# EAGLE design LedEsp32 (EAGLE 9.6.2)
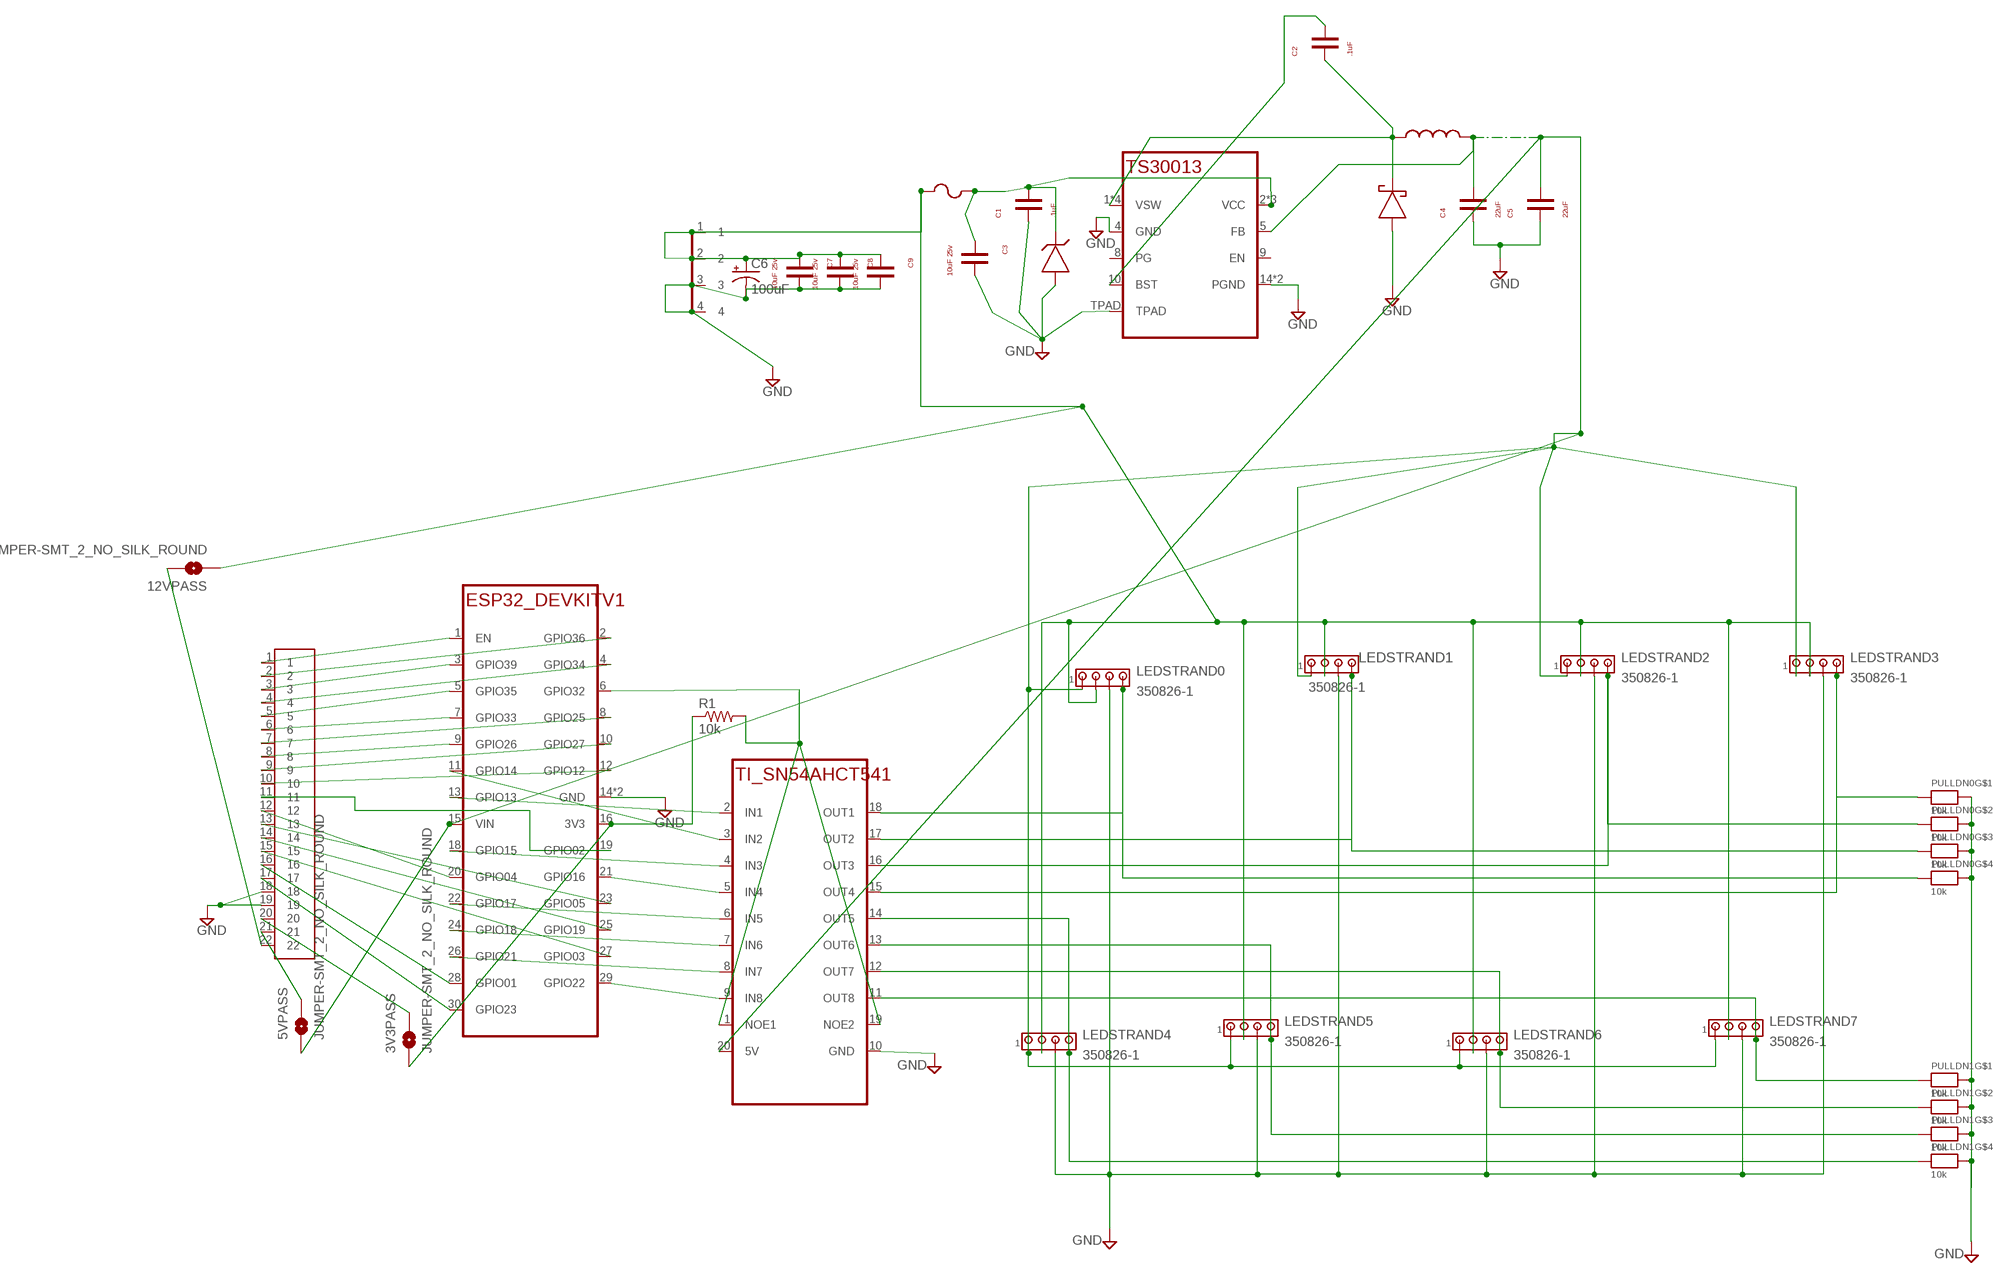
[diagram p0: schematic, sheet 1]

## Parts
3V3PASS  JUMPER-SMT_2_NO_SILK_ROUND  [SMT-JUMPER_2_NO_SILK_ROUND]
5VPASS  JUMPER-SMT_2_NO_SILK_ROUND  [SMT-JUMPER_2_NO_SILK_ROUND]
12VPASS  JUMPER-SMT_2_NO_SILK_ROUND  [SMT-JUMPER_2_NO_SILK_ROUND]
C1  .1uF  CAPACITOR_NONPOLARC0603  [C0603]
C2  .1uF  CAPACITOR_NONPOLARC0603  [C0603]
C3  10uF 25v  CL31A106MAHNNNEC1206  [C1206]
C4  22uF  GRM188R61A226ME15DC0603  [C0603]
C5  22uF  GRM188R61A226ME15DC0603  [C0603]
C6  100uF  CPOL-USE2.5-6  [E2,5-6]
C7  10uF 25v  CL31A106MAHNNNEC1206  [C1206]
C8  10uF 25v  CL31A106MAHNNNEC1206  [C1206]
C9  10uF 25v  CL31A106MAHNNNEC1206  [C1206]
D2  LS54LS54  [LS54]
F1  3A  FUSER0603  [R0603]
IC1  TS30013QFN16  [QFN16]
L1  SRN5040TA-4R7MSRN5040TA  [SRN5040TA]
LEDSTRAND0  350826-1  [350826-1]
LEDSTRAND1  350826-1  [350826-1]
LEDSTRAND2  350826-1  [350826-1]
LEDSTRAND3  350826-1  [350826-1]
LEDSTRAND4  350826-1  [350826-1]
LEDSTRAND5  350826-1  [350826-1]
LEDSTRAND6  350826-1  [350826-1]
LEDSTRAND7  350826-1  [350826-1]
PULLDN0  10k  RESISTOR_4PACK  [RESPACK_4X0603]
PULLDN1  10k  RESISTOR_4PACK  [RESPACK_4X0603]
R1  10k  R-US_R0603  [R0603]
U$1  ESP32_DEVKITV1ESP32_DEVKITV1DEVINST  [ESP32_DEVKITV1]
U$2  TI_SN54AHCT541SO20WDEVINST  [SO20W]
U$3  1X22THM  [1X22]
U$4  TE-1969806-1TE-1969806-1DEVINST  [TE-1969806-1]
Z1  CZRB5353B-HF DO-214AADEVINST  CZRB5353B-HF‎DO-214AADEVINST  [DO-214AA]

## Nets
3V3: 3V3PASS.1 R1.1 U$1.16(3V3)
3V3PASS [general_data]: 3V3PASS.2 U$3.20
GND: C1.1 C3.2 C4.1 C5.1 C6.- C7.2 C8.2 C9.2 D2.1 IC1.4(GND) IC1.14(PGND) IC1.15(PGND) IC1.TPAD LEDSTRAND0.3 LEDSTRAND1.3 LEDSTRAND2.3 LEDSTRAND3.3 LEDSTRAND4.3 LEDSTRAND5.3 LEDSTRAND6.3 LEDSTRAND7.3 PULLDN0.5 PULLDN0.6 PULLDN0.7 PULLDN0.8 PULLDN1.5 PULLDN1.6 PULLDN1.7 PULLDN1.8 U$1.14(GND) U$1.17(GND) U$2.10(GND) U$3.18 U$3.19 U$4.3 U$4.4 Z1.1
LEDEN [general_data]: R1.2 U$1.6(GPIO32) U$2.1(NOE1) U$2.19(NOE2)
N$1 [general_data]: LEDSTRAND0.4 PULLDN0.4 U$2.18(OUT1)
N$2 [general_data]: U$1.19(GPIO02) U$3.11
N$3 [general_data]: C2.1 D2.2 IC1.1(VSW) IC1.12(VSW) IC1.13(VSW) IC1.16(VSW) L1.1
N$5 [general_data]: C2.2 IC1.10(BST)
N$6 [general_data]: LEDSTRAND1.4 PULLDN0.3 U$2.17(OUT2)
N$7 [general_data]: LEDSTRAND2.4 PULLDN0.2 U$2.16(OUT3)
N$8 [general_data]: LEDSTRAND3.4 PULLDN0.1 U$2.15(OUT4)
N$9 [general_data]: LEDSTRAND4.4 PULLDN1.4 U$2.14(OUT5)
N$10 [general_data]: LEDSTRAND5.4 PULLDN1.3 U$2.13(OUT6)
N$11 [general_data]: LEDSTRAND6.4 PULLDN1.2 U$2.12(OUT7)
N$12 [general_data]: LEDSTRAND7.4 PULLDN1.1 U$2.11(OUT8)
N$13 [general_data]: U$1.11(GPIO14) U$2.3(IN2)
N$14 [general_data]: U$1.13(GPIO13) U$2.2(IN1)
N$15 [general_data]: U$1.18(GPIO15) U$2.4(IN3)
N$16 [general_data]: U$1.21(GPIO16) U$2.5(IN4)
N$17 [general_data]: U$1.22(GPIO17) U$2.6(IN5)
N$18 [general_data]: U$1.24(GPIO18) U$2.7(IN6)
N$19 [general_data]: U$1.26(GPIO21) U$2.8(IN7)
N$20 [general_data]: U$1.29(GPIO22) U$2.9(IN8)
N$23 [general_data]: U$1.1(EN) U$3.1
N$24 [general_data]: U$1.2(GPIO36) U$3.2
N$25 [general_data]: U$1.3(GPIO39) U$3.3
N$26 [general_data]: U$1.4(GPIO34) U$3.4
N$27 [general_data]: U$1.5(GPIO35) U$3.5
N$28 [general_data]: U$1.7(GPIO33) U$3.6
N$29 [general_data]: U$1.8(GPIO25) U$3.7
N$30 [general_data]: U$1.9(GPIO26) U$3.8
N$31 [general_data]: U$1.10(GPIO27) U$3.9
N$32 [general_data]: U$1.12(GPIO12) U$3.10
N$34 [general_data]: U$1.20(GPIO04) U$3.12
N$35 [general_data]: U$1.23(GPIO05) U$3.13
N$36 [general_data]: U$1.25(GPIO19) U$3.14
N$37 [general_data]: U$1.27(GPIO03) U$3.15
N$38 [general_data]: U$1.28(GPIO01) U$3.16
N$39 [general_data]: U$1.30(GPIO23) U$3.17
N$40 [general_data]: 5VPASS.2 U$3.21
N$41 [general_data]: 12VPASS.2 U$3.22
V5: 5VPASS.1 C4.2 C5.2 IC1.5(FB) L1.2 LEDSTRAND0.1 LEDSTRAND1.1 LEDSTRAND2.1 LEDSTRAND3.1 LEDSTRAND4.1 LEDSTRAND5.1 LEDSTRAND6.1 LEDSTRAND7.1 U$1.15(VIN) U$2.20(5V)
V12_FUSED: C1.2 C3.1 F1.2 IC1.2(VCC) IC1.3(VCC) IC1.11(VCC) Z1.2
VCC: 12VPASS.1 C6.+ C7.1 C8.1 C9.1 F1.1 LEDSTRAND0.2 LEDSTRAND1.2 LEDSTRAND2.2 LEDSTRAND3.2 LEDSTRAND4.2 LEDSTRAND5.2 LEDSTRAND6.2 LEDSTRAND7.2 U$4.1 U$4.2
Unconnected: IC1.8(PG) IC1.9(EN)

## Library data of the parts
3V3PASS 5VPASS 12VPASS = SparkFun-Jumpers:JUMPER-SMT_2_NO: Normally open jumper This jumper has two pads in close proximity to each other. Apply solder to close the connection. Round pads are easier to solder for beginners, but are a lot larger. SparkFun Product that uses the round pads: SparkFun EL Sequencer <https://www.sparkfun.com/products/12781>
C1 C2 = ledinlinesupply:CAPACITOR_NONPOLAR
C3 C7-C9 = ledinlinesupply:CL31A106MAHNNNE
C4 C5 = ledinlinesupply:GRM188R61A226ME15D
C6 = rcl:CPOL-US: POLARIZED CAPACITOR, American symbol; SPICEPREFIX: C
D2 = ledinlinesupply:LS54
F1 = ledinlinesupply:FUSE
IC1 = ledinlinesupply:TS30013
L1 = ledinlinesupply:SRN5040TA-4R7M
LEDSTRAND0 LEDSTRAND1-LEDSTRAND7 = con-amp:350826-1: Universal MATE-N-LOK .250" Centerline, 600 V, 19 - 36 A max Source: http://catalog.tycoelectronics.com/ .. ENG_CD_350826_P.pdf
PULLDN0 PULLDN1 = microbuilder:RESISTOR_4PACK: Resistor Packs (4 resistors) 4 x 0603 10K 1/16W - Digikey: YC164J-10KCT-ND
R1 = adafruit:R-US_: RESISTOR, American symbol
U$1 = esp32:ESP32_DEVKITV1
U$2 = esp32:TI_SN54AHCT541
U$3 = adafruit:1X22
U$4 = ledinlinesupply:TE-1969806-1
Z1 = ledinlinesupply:CZRB5353B-HF‎

## Net classes
1 general_data: width 0.305 mm
3 CHIPCOM: width 0.203 mm, clearance 0.152 mm

## Board
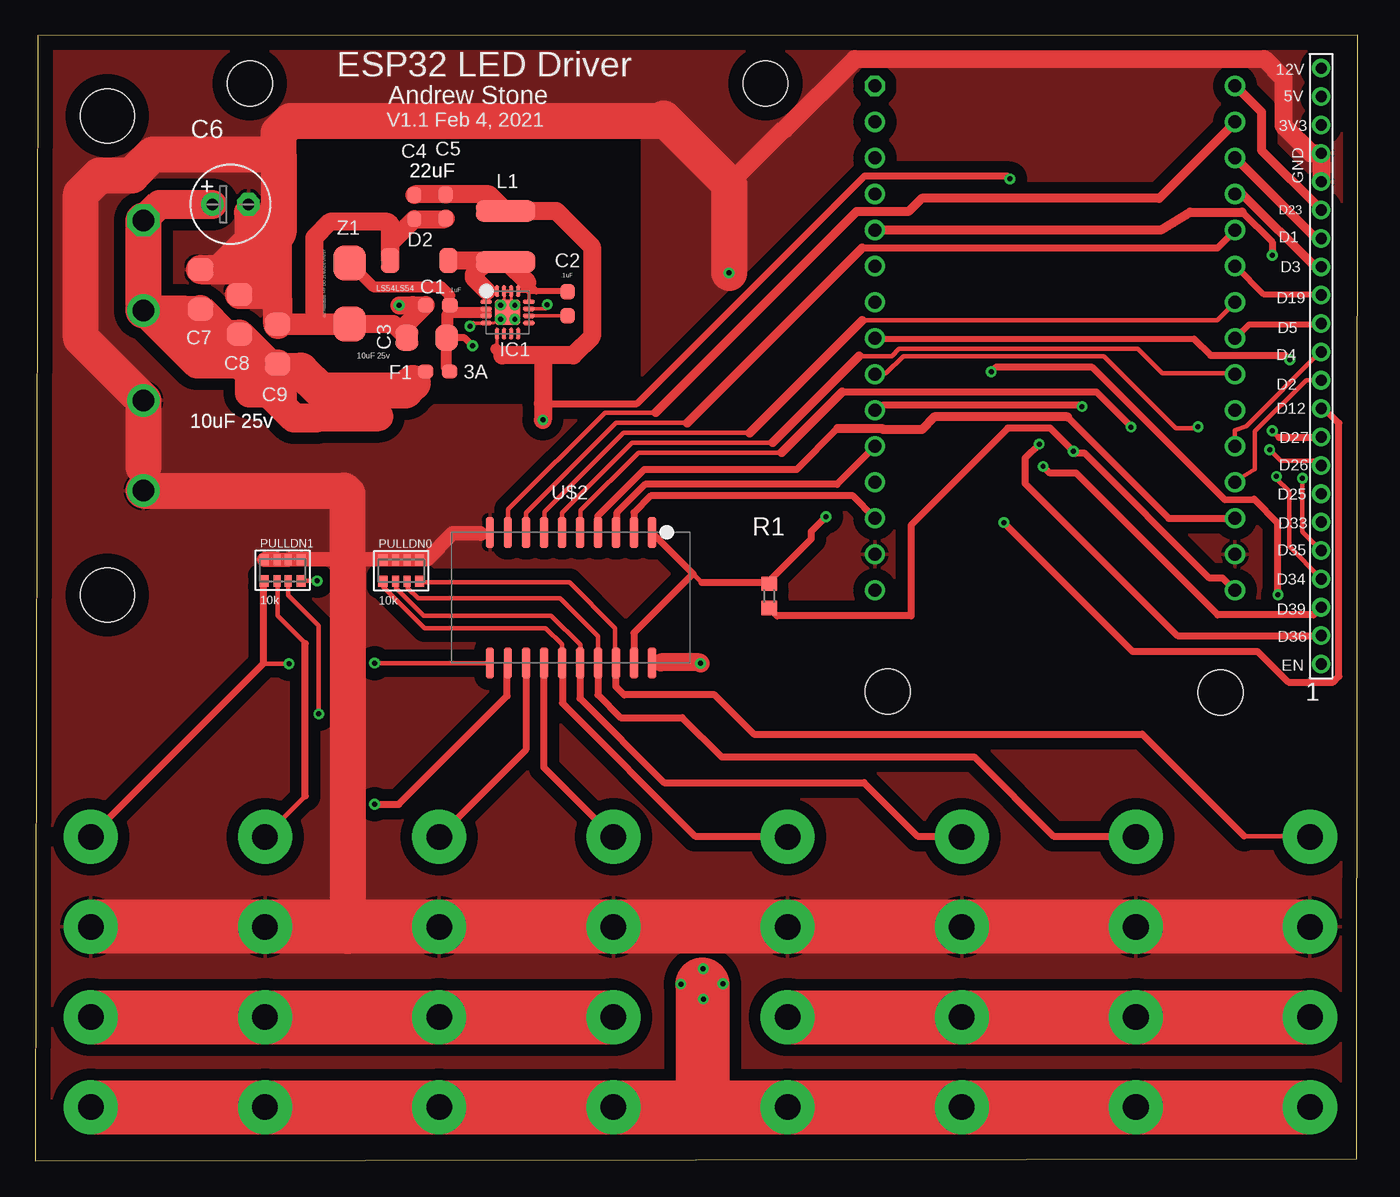
[diagram p1: board, top side]
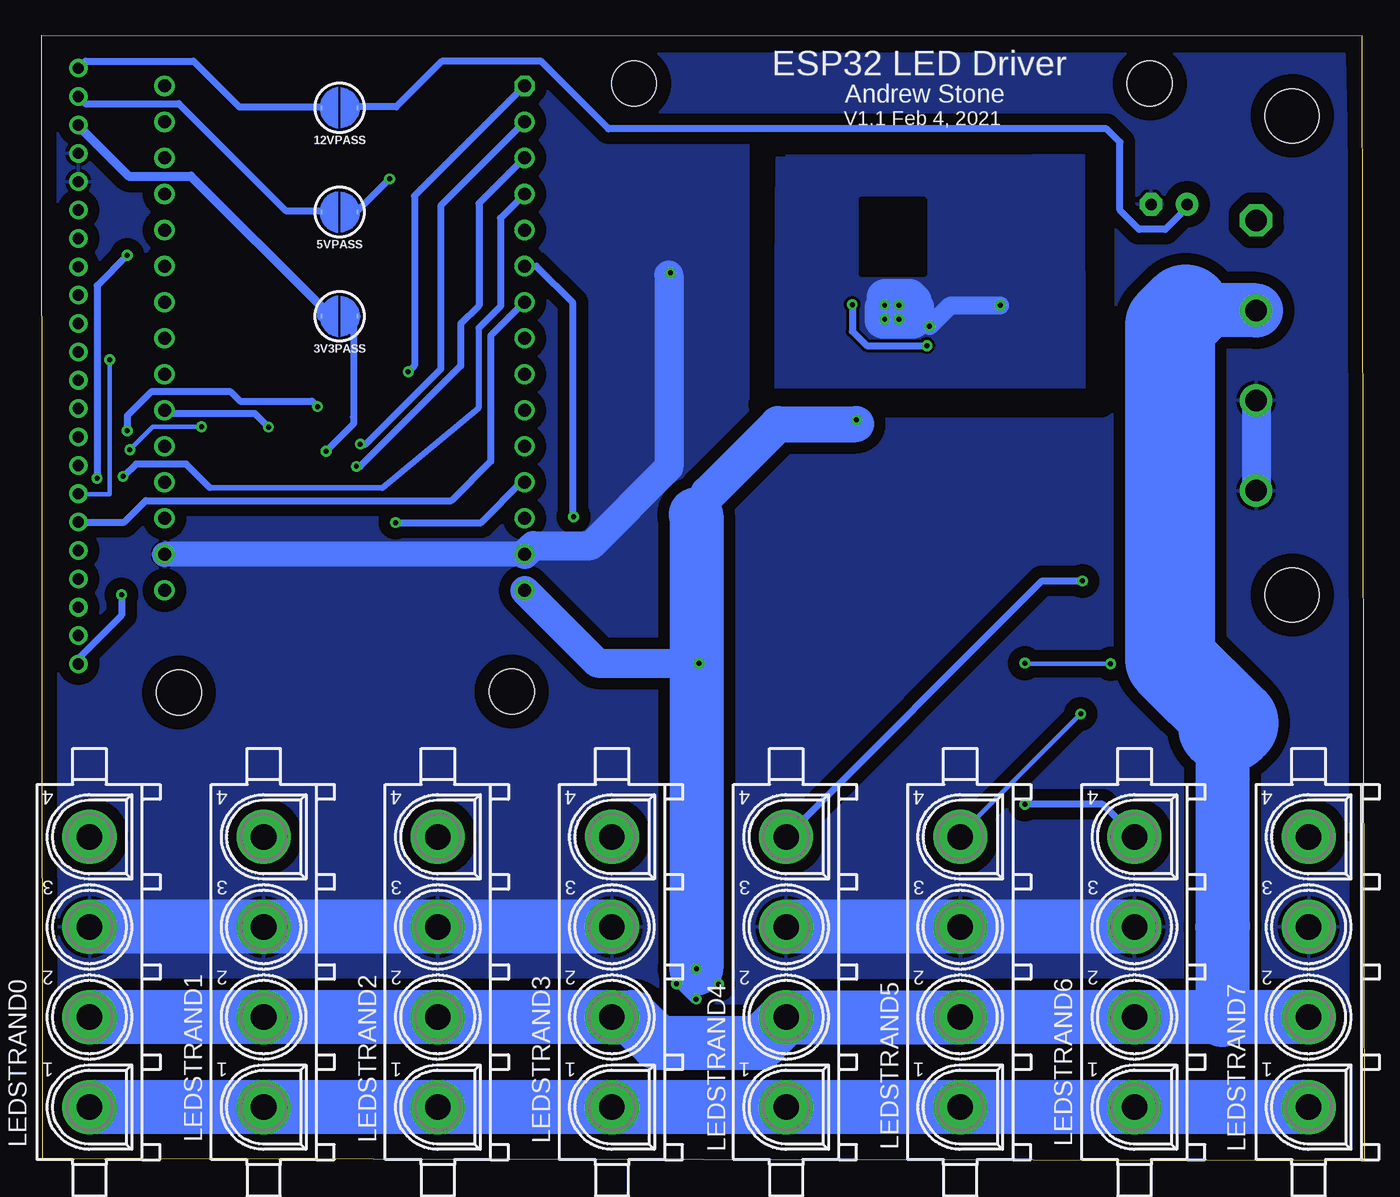
[diagram p2: board, bottom side, seen from below]

Size 93.25 x 79.33 mm. Coordinates in mm from the lower left corner, seen from the top.
Outline: 0,0 93.18,0.13 93.25,79.33 0.18,79.3 0,0
Copper layers (1*16): Top 0.035mm / dielectric 1.5mm / Bottom 0.035mm
Design rules "default *": minimum track width 8mil, minimum drill 0.35mm, track to track 8mil, track to pad 8mil, pad to pad 8mil, via to via 8mil, smd to smd 8mil, copper to edge 40mil, drill to drill 6mil, minimum pad ring 10mil, minimum via ring 8mil, stop-mask expansion 4mil, vias tented up to drill 0mil, thermal gap 10mil
Holes 3.17 mm at 15.11,75.95 51.48,75.95 60.11,33.08 83.58,33.01
tKeepout: area 30.9,62.4 to 35.5,67.9
tRestrict: area 30.9,62.5 to 35.5,67.9; area 18.6,53.6 to 41.8,71.9; area 18.5,53.5 to 19.6,71.9
bRestrict: area 30.9,62.4 to 35.5,67.8; area 18.5,53.3 to 42.5,72; area 18.5,53.3 to 19.6,71.9

### Footprints (pad centres in the part's own frame; a part is rotated, then mirrored left to right if it is on the bottom)
SMT-JUMPER_2_NO_SILK_ROUND = smd 0.152 x 0.305: 1 -1.27,0; 2 1.27,0
C0603 = smd 1.1 x 1: 1 -0.85,0; 2 0.85,0
C1206 = smd 1.6 x 1.8: 1 -1.4,0; 2 1.4,0
E2,5-6 = drill 0.813 pad 1.6: + -1.27,0 | drill 0.813 pad 1.6 octagon: - 1.27,0
LS54 = smd 1.3 x 1.75: 1 -2.05,0; 2 2.05,0
R0603 = smd 1.1 x 1: 1 -0.85,0; 2 0.85,0
QFN16 = smd 0.8 x 0.3: 1 -1.5,0.75; 2 -1.5,0.25; 3 -1.5,-0.25; 4 -1.5,-0.75; 9 1.5,-0.75; 10 1.5,-0.25; 11 1.5,0.25; 12 1.5,0.75 | smd 0.3 x 0.8: 5 -0.75,-1.5; 6 -0.25,-1.5; 7 0.25,-1.5; 8 0.75,-1.5; 13 0.75,1.5; 14 0.25,1.5; 15 -0.25,1.5; 16 -0.75,1.5 | smd 1.8 x 1.8: TPAD 0,0
SRN5040TA = smd 1.5 x 4.2: 1 -1.8,0; 2 1.8,0
350826-1 = drill 1.8 pad 3.81: 1 -9.525,0; 2 -3.175,0; 3 3.175,0; 4 9.525,0
RESPACK_4X0603 = smd 0.65 x 0.8: 1 -1.3,-0.75; 4 1.3,-0.75; 5 1.3,0.75; 8 -1.3,0.75 | smd 0.5 x 0.8: 2 -0.4,-0.75; 3 0.4,-0.75; 6 0.4,0.75; 7 -0.4,0.75
R0603' = smd 1 x 1.1: 1 -0.85,0; 2 0.85,0
ESP32_DEVKITV1 = drill 0.914 octagon: 1 -17.78,-12.7 | drill 0.914: 2 -15.24,-12.7; 3 -12.7,-12.7; 4 -10.16,-12.7; 5 -7.62,-12.7; 6 -5.08,-12.7; 7 -2.54,-12.7; 8 0,-12.7; 9 2.54,-12.7; 10 5.08,-12.7; 11 7.62,-12.7; 12 10.16,-12.7; 13 12.7,-12.7; 14 15.24,-12.7; 15 17.78,-12.7; 16 17.78,12.7; 17 15.24,12.7; 18 12.7,12.7; 19 10.16,12.7; 20 7.62,12.7; 21 5.08,12.7; 22 2.54,12.7; 23 0,12.7; 24 -2.54,12.7; 25 -5.08,12.7; 26 -7.62,12.7; 27 -10.16,12.7; 28 -12.7,12.7; 29 -15.24,12.7; 30 -17.78,12.7
SO20W = smd 0.6 x 2.2: 1 -5.715,-4.6; 2 -4.445,-4.6; 3 -3.175,-4.6; 4 -1.905,-4.6; 5 -0.635,-4.6; 6 0.635,-4.6; 7 1.905,-4.6; 8 3.175,-4.6; 9 4.445,-4.6; 10 5.715,-4.6; 11 5.715,4.6; 12 4.445,4.6; 13 3.175,4.6; 14 1.905,4.6; 15 0.635,4.6; 16 -0.635,4.6; 17 -1.905,4.6; 18 -3.175,4.6; 19 -4.445,4.6; 20 -5.715,4.6
1X22 = drill 0.8: 1 -21,0; 2 -19,0; 3 -17,0; 4 -15,0; 5 -13,0; 6 -11,0; 7 -9,0; 8 -7,0; 9 -5,0; 10 -3,0; 11 -1,0; 12 1,0; 13 3,0; 14 5,0; 15 7,0; 16 9,0; 17 11,0; 18 13,0; 19 15,0; 20 17,0; 21 19,0; 22 21,0
TE-1969806-1 = drill 1.52 octagon: 1 -9.525,0 | drill 1.52: 2 -3.175,0; 3 3.175,0; 4 9.525,0 | hole 3.81: -16.89,2.54; 16.89,2.54
DO-214AA = smd 2.5 x 2.3: 1 -2.15,0; 2 2.15,0

### Placement (x,y rotation side)
3V3PASS  72.25,59.53 180 bottom
5VPASS  72.25,66.88 180 bottom
12VPASS  72.25,74.23 180 bottom
C1  28.37,60.32 0 top
C2  37.54,60.42 270 top
C3  27.6,58.02 180 top
C4  26.72,67.22 90 top
C5  28.93,67.28 90 top
C6  13.76,67.43 0 top
C7  11.64,61.42 90 top
C8  14.39,59.67 90 top
C9  17.09,57.56 90 top
D2  27.07,63.47 0 top
F1  28.36,55.63 0 top
IC1  33.29,59.81 0 top
L1  33.17,65.16 90 top
LEDSTRAND0  89.89,13.3 90 bottom
LEDSTRAND1  77.61,13.3 90 bottom
LEDSTRAND2  65.32,13.3 90 bottom
LEDSTRAND3  53.04,13.3 90 bottom
LEDSTRAND4  40.76,13.3 90 bottom
LEDSTRAND5  28.47,13.3 90 bottom
LEDSTRAND6  16.19,13.3 90 bottom
LEDSTRAND7  3.91,13.3 90 bottom
PULLDN0  25.8,41.6 0 top
PULLDN1  17.43,41.62 0 top
R1  10k  [R0603']  51.75,39.82 90 top
U$1  71.9,57.99 270 top
U$2  37.76,39.7 180 top
U$3  90.68,56.02 90 top
U$4  7.61,56.77 270 bottom
Z1  22.15,61.14 90 top

### Tracks (layer width: path | path; a pad name or v marks a point on that pad's centre or on a via)
3V3  (via drill 0.35)
  Top 0.508: U$1.16 83.73,41.08 82.8,41.08 74.01,49.86 73.35,49.86 v73.2,50.02 71.57,51.64 68.58,51.64 61.74,44.81 61.74,38.41 52.3,38.41 R1.1
  Bottom 0.508: v73.2,50.02 71.27,51.95 71.27,52.43 71.27,59.24 3V3PASS.1
3V3PASS
  Bottom 0.305: 90.67,72.98 U$3.20
  Bottom 0.635: 3V3PASS.2 73.52,60.19 82.75,69.42 87.12,69.42 90.67,72.98
GND  (via drill 0.35)
  Top 0.203: IC1.14 33.54,60.06 IC1.TPAD | IC1.15 33.04,60.76 32.91,60.62 32.91,59.62 32.34,59.06 IC1.4 | 17.12,42.4 PULLDN1.7 | PULLDN1.5 18.74,42.4 | PULLDN0.8 24.43,42.4 | LEDSTRAND6.3 16.2,16.49 16.2,16.48 | LEDSTRAND4.3 40.79,16.49 40.79,16.48 | LEDSTRAND3.3 53.08,16.49 53.08,16.48 | LEDSTRAND2.3 65.38,16.49 65.38,16.48 | LEDSTRAND1.3 77.67,16.49 77.67,16.48
  Top 0.254: IC1.14 IC1.15 | IC1.4 30.88,59.06 | 30.88,59.06 | 30.88,59.06 30.86,59.06 v30.64,58.83 | 26.61,60.3 26.62,60.32
  Top 0.406: PULLDN1.5 PULLDN1.6
  Top 0.508: 31.39,44.2 31.95,44.2 U$2.10 | PULLDN0.5 PULLDN0.6 | 24.43,42.4 24.48,42.35 PULLDN0.6 | PULLDN0.7 PULLDN0.6 | PULLDN1.5 17.95,42.37 17.93,42.4 | PULLDN1.6 17.14,42.37 17.12,42.4
  Top 1.016: 17.93,42.4 18.74,42.4 21.99,42.4 22.02,42.4 24.43,42.4 27.61,42.4 29.43,44.22 31.36,44.22 31.39,44.2 | 17.12,42.4 16.16,42.4 PULLDN1.8 PULLDN1.6
  Top 1.27: Z1.1 25.23,58.99 C3.2 26.2,58.99 C1.1 26.62,60.32 | C5.1 28.87,66.37 C4.1 25.02,64.68 D2.1 25.02,65.92 25.07,65.97 24.85,66.18 20.76,66.18 19.66,65.08 19.66,58.96 | v25.65,60.3 26.61,60.3 | 48.92,68.86 52.76,72.71 52.83,72.71 57.79,77.67 86.66,77.68 88.01,76.33 88.01,72.98 89.96,71.02 U$3.19 U$3.18 | 15.67,62.54 15.03,63.18 C6.-
  Top 1.524: Z1.1 22.13,58.96 19.66,58.96 C9.2
  Top 2.032: 15.03,66.83 15.03,64.89 12.96,62.82 C7.2 14.42,62.82 14.73,62.51 14.73,61.41 C8.2 16.65,61.07 17.09,60.64 C9.2 17.09,65.37
  Top 2.54: 7.61,48.92 U$4.3 3.2,58.01 3.2,68.15 4.52,69.47 6.8,69.47 8.28,70.94 17.14,70.94 | U$4.4 21.76,47.25 21.99,47.02 21.99,42.4 | 22.02,42.4 22.02,16.48 | 17.14,70.94 17.14,72.46 17.98,73.31 44.17,73.31 44.32,73.46 48.92,68.86 v48.92,62.59 | 17.14,70.94 17.14,65.42 17.09,65.37 15.74,64.03 15.74,62.54 15.67,62.54
  Top 3.81: LEDSTRAND0.3 77.67,16.48 LEDSTRAND1.3 65.38,16.48 LEDSTRAND2.3 53.08,16.48 LEDSTRAND3.3 40.79,16.48 LEDSTRAND4.3 LEDSTRAND5.3 22.02,16.48 16.2,16.48 LEDSTRAND6.3 LEDSTRAND7.3
  Bottom 0.508: v48.92,62.59 49.02,62.49 49.02,62.44
  Bottom 1.27: v25.65,60.3 29.17,60.3 v30.64,58.83 31.59,59.78 31.59,60.13
  Bottom 1.778: U$1.14 U$1.17
  Bottom 2.032: U$4.3 U$4.4 | U$1.14 58.59,43.36 54.53,43.36 49.02,48.87 49.02,62.44
  Bottom 2.54: 31.59,60.13 33.96,60.13 33.96,59.24 31.8,59.24 31.77,59.26 31.77,60.61 32.05,60.89 33.8,60.89
  Bottom 3.81: LEDSTRAND6.3 LEDSTRAND4.3 | LEDSTRAND3.3 LEDSTRAND0.3
  pour Bottom: 19.78,70.88 41.41,70.68 41.53,54.45 19.75,54.45
  pour Top: 19.91,70.69 41.42,70.69 41.42,54.51 41.4,54.49 20.85,54.49 19.73,55.6 19.73,70.69 19.91,70.87
  pour Bottom (isolate 0.813): 1.39,78.01 92.35,78.01 92.35,1.12 92.17,0.94 1.24,0.94 0.96,1.22 0.96,72.75 1.29,73.08
  pour Top (isolate 0.813): 1.11,78.41 92.45,78.41 92.55,78.51 92.55,1.15 92.4,0.99 0.94,0.99 0.83,1.1 0.83,77.47 0.89,77.52
LEDEN  (via drill 0.35)
  Top 0.305: 46.38,41.38 46.99,40.77 | 51.66,40.77 R1.2 51.76,40.87 | 43.53,44.22 U$2.1 | 42.21,35.18 U$2.19
  Top 0.508: 46.99,40.77 51.66,40.77 | 43.53,44.22 46.38,41.38 42.21,37.21 42.21,35.18 | v55.75,45.39 54.71,44.35 54.71,43.82 51.76,40.87
  Bottom 0.508: U$1.6 58.39,63.07 55.8,60.48 55.8,45.44 v55.75,45.39
N$1
  Top 0.305: PULLDN0.4 27.17,40.77 37.66,40.77 40.89,37.54 40.89,35.18 U$2.18 40.94,35.09 | 85.24,22.89 89.86,22.89 LEDSTRAND0.4
  Top 0.508: 85.24,22.89 78.05,30.08 50.67,30.08 47.9,32.84 41.52,32.84 40.94,33.43 40.94,35.09
N$2
  Top 0.305: U$3.11 89.61,55.02 86,51.41 86,48.74 84.72,47.96 U$1.19
N$3
  Top 0.254: C2.1 37.51,61.29 | IC1.13 34.06,61.29 34.79,61.29 IC1.12 | IC1.16 31.84,61.31 31.83,61.31 31.79,61.27 IC1.1
  Top 0.406: 37.51,61.29 35.33,61.29 | 35.33,61.29 34.79,61.29 | 34.69,61.93 35.33,61.29
  Top 1.27: D2.2 33.06,63.47 L1.1 | L1.1 31.8,63.36 30.91,62.46 30.91,62.23 31.83,61.31 | L1.1 33.26,63.36 34.69,61.93
N$4  (via drill 0.35)
  other vias: 32.81,60.32
N$5
  Top 0.254: C2.2 37.53,59.56 IC1.10
N$6
  Top 0.305: PULLDN0.3 26.26,40.77 26.26,40.36 26.97,39.65 37,39.65 39.67,36.98 U$2.17 39.67,34.98 | 77.57,22.89 LEDSTRAND1.4
  Top 0.508: 77.57,22.89 71.8,22.89 66.21,28.48 48.38,28.48 45.61,31.25 41.27,31.25 39.67,32.84 39.67,34.98
N$7
  Top 0.305: PULLDN0.2 25.45,40.77 25.45,40.36 27.38,38.43 36.37,38.43 38.43,36.38 38.43,35.13 U$2.16 38.4,35.09 | 65.27,22.89 LEDSTRAND2.4
  Top 0.508: 65.27,22.89 62.2,22.89 58.44,26.65 44.34,26.65 38.4,32.59 38.4,35.09
N$8
  Top 0.305: PULLDN0.1 24.53,40.77 24.53,40.47 27.45,37.54 35.99,37.54 37.13,36.4 U$2.15 37.16,34.35 | 52.98,22.89 LEDSTRAND3.4
  Top 0.508: 52.98,22.89 46.53,22.89 37.16,32.26 37.16,34.35
N$9  (via drill 0.35)
  Top 0.305: v19.86,40.87 PULLDN1.4 | U$2.14 | 40.69,22.89 LEDSTRAND4.4
  Top 0.508: U$2.14 35.86,27.71 40.69,22.89
  Bottom 0.305: 40.69,22.89 LEDSTRAND4.4
  Bottom 0.508: v19.86,40.87 22.7,40.87 40.69,22.89
N$10  (via drill 0.35)
  Top 0.305: v19.99,31.5 19.99,37.7 17.83,39.86 PULLDN1.3 | 28.49,22.89 LEDSTRAND5.4
  Top 0.508: U$2.13 34.59,28.98 28.49,22.89
  Bottom 0.305: LEDSTRAND5.4 28.47,23.01 v19.99,31.5
N$11  (via drill 0.35)
  Top 0.305: 19.02,36.48 17.06,38.43 17.06,40.87 PULLDN1.2 | 19.02,25.71 16.2,22.89 LEDSTRAND6.4 | 33.27,35.08 U$2.12
  Top 0.508: 19.02,25.71 19.02,36.48 | 33.27,35.08 33.27,32.77 25.62,25.12 v23.92,25.12
  Bottom 0.305: 16.2,22.89 LEDSTRAND6.4
  Bottom 0.508: v23.92,25.12 18.44,25.12 16.2,22.89
N$12  (via drill 0.35)
  Top 0.305: 16.1,40.87 PULLDN1.1 | 3.91,22.89 LEDSTRAND7.4 | v23.92,35.08 31.95,35.08 U$2.11 | 16.05,35.03 v17.88,35.03
  Top 0.508: 16.1,40.87 16.1,35.08 16.05,35.03 3.91,22.89
  Bottom 0.305: v17.88,35.03 23.87,35.03 v23.92,35.08
N$13
  Top 0.305: 40.99,44.33 U$2.3 | 59.18,50.32 U$1.11
  Top 0.508: 40.99,44.33 40.99,45.67 43,47.68 56.54,47.68 59.18,50.32
N$14
  Top 0.305: 42.21,44.33 U$2.2 | 59.18,45.34 U$1.13
  Top 0.508: 42.21,44.33 42.21,45.7 43.38,46.87 57.65,46.87 59.18,45.34
N$15
  Top 0.508: U$2.4 39.67,45.46 42.95,48.75 53.7,48.75 56.58,51.63 | U$1.18 79.93,45.29 72.79,52.43
  Top 0.635: 72.79,52.43 63.4,52.43 62.51,51.54 59.77,51.54 59.71,51.6 56.6,51.6 56.58,51.63
N$16  (via drill 0.35)
  Top 0.305: 52.62,49.91 42.52,49.91 38.45,45.85 38.45,44.33 U$2.5 | v77.26,51.72 77.26,51.77
  Top 0.508: 77.26,51.77 74.85,54.18 56.89,54.18
  Top 0.635: 56.89,54.18 52.62,49.91
  Bottom 0.305: 84.4,52.68 84.58,52.86 U$1.21
  Bottom 0.508: v77.26,51.72 78.23,52.68 84.4,52.68
N$17
  Top 0.305: 51.99,50.62 42.06,50.62 37.13,45.7 37.13,44.33 U$2.6 | 58.09,56.72 60.4,56.72 60.91,57.23 77.75,57.23 79.47,55.5 84.58,55.5 U$1.22
  Top 0.635: 58.09,56.72 51.99,50.62
N$18
  Top 0.305: 50.39,51.31 41.47,51.31 35.91,45.75 35.91,44.33 U$2.7 | 58.31,59.24 83.33,59.24 84.58,60.48 U$1.24
  Top 0.635: 58.31,59.24 50.39,51.31
N$19
  Top 0.305: 45.97,52.02 40.94,52.02 34.59,45.67 34.59,44.33 U$2.8 | 84.58,65.56 U$1.26
  Top 0.508: 58.29,64.34 83.36,64.34 84.58,65.56
  Top 0.635: 58.29,64.34 45.97,52.02
N$20
  Top 0.305: 43.73,52.73 40.15,52.73 33.35,45.93 33.35,44.31 U$2.9 | 84.58,73.18 U$1.29
  Top 0.635: 43.73,52.73 57.91,66.91 61.57,66.91 62.51,67.85 79.24,67.85 84.58,73.18
N$22  (via drill 0.35)
  other vias: 33.81,60.32
N$23  (via drill 0.35)
  Top 0.305: v67.41,55.63 67.71,55.93
  Top 0.508: v87.63,39.91 87.63,44.94 85.95,46.64 83.87,46.61 74.54,55.93 67.71,55.93
  Bottom 0.305: 90.65,35.43 U$3.1 | 59.28,75.72 U$1.1
  Bottom 0.508: 90.65,35.43 87.63,38.46 v87.63,39.91 | v67.41,55.63 66.98,56.06 66.98,68.02 59.28,75.72
N$24  (via drill 0.35)
  Top 0.508: v70.79,50.52 69.8,49.53 69.8,47.76 80.53,37.02 U$3.2
  Bottom 0.508: U$1.2 65.12,67.31 65.12,55.81 70.4,50.52 v70.79,50.52
N$25  (via drill 0.35)
  Top 0.508: U$3.3 90.14,38.48 83.38,38.48 73.4,48.47 71.55,48.47 v71.07,48.95
  Bottom 0.305: v71.07,48.95 70.79,48.95 | 59.28,70.64 U$1.3
  Bottom 0.508: 70.79,48.95 63.7,56.03 63.7,59.01 62.43,60.28 62.43,67.49 59.28,70.64
N$26  (via drill 0.35)
  Top 0.305: v87.52,48.24 87.52,48.09 88.41,47.2 88.41,43.31 90.65,41.08 90.67,41.08 U$3.4
  Bottom 0.406: 81.38,47.45 69.24,47.42 62.45,53.05 62.44,58.69
  Bottom 0.508: U$1.4 60.9,66.45 60.9,60.23 62.44,58.69 | 81.38,47.45 81.4,47.45 83.05,49.1 86.61,49.1 87.47,48.24 v87.52,48.24
N$27  (via drill 0.35)
  Top 0.305: U$3.5 90.66,43.02 89.35,44.33 v89.35,48.11
  Top 0.508: 85.11,66.88 87.22,64.77 v87.22,63.83
  Top 0.635: 85.11,66.88 81.44,66.88 79.36,65.61 U$1.5
  Bottom 0.508: v87.22,63.83 89.35,61.7 v89.35,48.11
N$28
  Bottom 0.305: U$1.7 59.28,60.48
  Bottom 0.508: 59.28,60.48 61.59,58.17 61.59,49.3 64.36,46.54 85.91,46.54 87.43,45.02 U$3.6
N$29  (via drill 0.35)
  Top 0.305: v88.46,56.47 88.16,56.77 | 59.28,57.94 U$1.8
  Top 0.406: 59.28,57.94 81.71,57.94
  Top 0.508: 88.16,56.77 82.88,56.77 81.71,57.94
  Bottom 0.305: v88.46,56.47 88.46,46.97 90.67,46.97 U$3.7
N$30  (via drill 0.35)
  Top 0.305: v87.04,50.12 87.83,49.33 90.66,49.33 U$3.8 | v81.99,51.74 81.89,51.64 80.41,51.64 75.33,56.72 61.21,56.72 59.99,55.5 59.28,55.5 U$1.9
  Bottom 0.305: v81.99,51.74 85.42,51.74 v87.04,50.12
N$31  (via drill 0.35)
  Top 0.305: U$3.9 90.64,50.98 | 87.7,50.98 v87.22,51.46 | 73.71,53.27 v73.81,53.16 | 59.78,53.27 U$1.10
  Top 0.508: 90.64,50.98 87.7,50.98 | 73.71,53.27 59.78,53.27
  Bottom 0.508: v87.22,51.46 87.22,52.53 85.54,54.21 79.93,54.21 79.27,53.55 74.19,53.55 v73.81,53.16
N$32  (via drill 0.35)
  Top 0.305: 91.31,52.61 91.31,52.65 U$3.10
  Top 0.508: 91.31,52.61 91.92,52 91.92,34.14 91.51,33.73 88.36,33.73 86.2,35.89 77.39,35.89 v68.3,44.99
  Bottom 0.305: 59.33,47.93 59.28,47.88 U$1.12
  Bottom 0.508: v68.3,44.99 62.28,44.99 59.33,47.93
N$33  (via drill 0.35)
  other vias: 33.81,59.32
N$34
  Top 0.305: U$3.12 90.62,57.02 85.39,51.8 84.6,51.48 U$1.20
N$35
  Top 0.305: 90.67,58.96 U$3.13 | 84.68,58.04 U$1.23
  Top 0.406: 90.67,58.96 85.59,58.96 84.68,58.04
N$36
  Top 0.305: 90.67,61.09 U$3.14 | 84.68,63.02 U$1.25
  Top 0.406: 90.67,61.09 86.61,61.09 84.68,63.02
N$37
  Top 0.305: 90.24,63.02 U$3.15
  Top 0.635: 90.24,63.02 85.11,68.15 U$1.27
N$38
  Top 0.305: 90.27,65.05 90.67,65.05 U$3.16 | 84.68,70.64 U$1.28
  Top 0.635: 84.68,70.64 90.27,65.05
N$39
  Top 0.305: U$3.17 | 84.68,75.72 U$1.30
  Top 0.635: U$3.17 86.46,71.25 86.46,73.94 84.68,75.72
N$40
  Bottom 0.305: 73.5,66.98 5VPASS.2 | 90.67,75.01 U$3.21
  Bottom 0.508: 73.5,66.98 76.04,66.98 83.59,74.53 90.19,74.53 90.67,75.01
N$41
  Bottom 0.305: 73.5,74.3 12VPASS.2
  Bottom 0.508: 73.5,74.3 79.32,74.3 82.55,77.52 90.17,77.52 U$3.22
N$44  (via drill 0.35)
  other vias: 32.81,59.32
V5  (via drill 0.35)
  Top 0.203: LEDSTRAND4.1 40.79,3.79 40.79,3.78
  Top 0.254: 32.46,57.23 32.54,57.32 IC1.5 | 47.01,12.42 47.01,13.46 v47.09,13.54
  Top 0.508: v68.73,69.22 68.53,69.42 58.47,69.42 42.41,53.37 35.78,53.37 | 44.12,35.13 43.51,35.13 U$2.20
  Top 0.762: 32.91,56.77 32.46,57.23 | v45.51,12.45 48.46,12.45 v48.48,12.47 | v47.1,11.39 47.1,12.37 47.06,12.37
  Top 1.27: C4.2 26.77,68.12 C5.2 32,68.12 L1.2 36.72,66.96 39.24,64.44 39.24,58.09 37.92,56.77 35.53,56.77 | 35.53,56.77 32.91,56.77 | 35.53,56.77 35.78,56.52 35.78,53.37 v35.78,52.23 | v46.91,35.05 46.83,35.13 44.12,35.13
  Top 3.81: LEDSTRAND4.1 40.79,3.78 47.06,3.78 | 47.06,3.78 LEDSTRAND3.1 | 47.06,3.78 47.06,12.37 47.01,12.42 | LEDSTRAND7.1 LEDSTRAND0.1
  Bottom 0.203: 70.96,66.98 5VPASS.1 | 35.81,51.92 35.81,52.15 v35.78,52.23 | v46.91,35.05 46.94,35.08 | 46.88,35.08 47.09,35.08 | 46.24,47.03 46.58,47.37 47.14,45.55
  Bottom 0.508: v68.73,69.22 70.96,66.98
  Bottom 0.762: v47.09,13.54 46.6,13.54 v45.51,12.45 | v48.48,12.47 48.33,12.63 v47.1,11.39
  Bottom 2.032: U$1.15 54.07,35.08 46.94,35.08
  Bottom 2.54: 46.24,47.03 41.35,51.92 35.81,51.92 | v46.91,35.05 46.88,35.08
  Bottom 3.81: v47.09,13.54 47.09,35.08 47.09,45.49 47.14,45.55 | LEDSTRAND7.1 LEDSTRAND6.1 LEDSTRAND5.1 LEDSTRAND4.1 LEDSTRAND3.1 LEDSTRAND2.1 LEDSTRAND1.1 LEDSTRAND0.1
V12_FUSED  (via drill 0.35)
  Top 0.254: IC1.11 36.02,60.06 36.09,60.12 v36.09,60.35 | IC1.2 31.79,59.8 IC1.3
  Top 0.508: v30.83,57.46 30.27,58.02 C3.1 29.22,58.24 C1.2
  Top 0.762: 31.79,59.8 29.16,59.8 29,59.64 C3.1 29,55.85 F1.2 | C1.2 29.22,61 28.6,61.62 23.82,61.62 23.74,61.7 Z1.2
  Bottom 0.508: v36.09,60.35 36.09,58.47 35.07,57.46 v30.83,57.46
VCC
  Top 0.508: 26.62,54.84 27.41,55.63 F1.1
  Top 2.032: C6.+ 8.74,67.43 U$4.1 | U$4.2 11.57,59.95 C7.1 13.4,58.27 C8.1 16.79,55.88 16.79,55.7 | C9.1 11.4,56.16 U$4.2 | U$4.2 9.62,59.95 12.67,56.9 14.98,56.9 15.08,56.8 15.08,54.13 17.39,54.13 17.39,53.2 | 17.39,53.2 18.24,52.35 19.82,52.35 19.93,52.45 24.23,52.45 | 17.39,53.2 10.65,59.95 U$4.2
  Top 2.54: U$4.1 U$4.2 | 26.62,54.84 26.08,54.31 20.11,54.31 18.72,55.7 16.79,55.7
  Top 3.81: LEDSTRAND7.2 LEDSTRAND4.2 | LEDSTRAND3.2 LEDSTRAND0.2
  Bottom 0.203: 70.96,74.3 12VPASS.1 | LEDSTRAND2.2 65.38,10.09 65.38,10.13 | LEDSTRAND1.2 77.67,10.09 77.67,10.13
  Bottom 0.508: 70.96,74.3 68.25,74.3 65.05,77.5 58.03,77.5 53.29,72.75 18.16,72.75 17.22,71.81 17.22,67.01 15.87,65.66 14.02,65.66 12.49,67.19 C6.+
  Bottom 1.27: 9.95,30.59 10,30.53 10,9.93
  Bottom 2.54: 9.95,16.54 10,16.49 | 10,9.93 9.93,9.86 4.18,9.86 LEDSTRAND7.2
  Bottom 3.81: 9.95,16.54 9.95,30.59 | 10,16.49 10,9.93 | LEDSTRAND7.2 LEDSTRAND6.2 LEDSTRAND5.2 LEDSTRAND4.2 42.58,8.31 49.83,8.31 51.65,10.13 LEDSTRAND3.2 LEDSTRAND2.2 65.38,10.13 LEDSTRAND1.2 77.67,10.13 LEDSTRAND0.2 | U$4.2 12.55,59.95 12.59,60
  Bottom 6.35: 12.59,60 13.69,58.91 13.69,35.33 9.22,30.86 9.5,30.59 9.95,30.59

### Text on the board
tPlace: ESP32 LED Driver | 12V | Andrew Stone | V1.1 Feb 4, 2021
bPlace: ESP32 LED Driver | Andrew Stone | V1.1 Feb 4, 2021
tNames: 5V | 3V3 | GND | D23 | D1 | D3 | D19 | D5 | D4 | D2 | D12 | D27 | D26 | D25 | D33 | D35 | D34 | D39 | D36 | EN
bDocu: 6-12V IN | GND | S7 | S6 | S5 | S4 | S3 | S2 | S1 | S0 | DATA | DATA | DATA | DATA | DATA | DATA | DATA | GND | GND | GND | GND | GND | GND | GND | 12V | 12V | 12V | 12V | 12V | 12V | 12V | 5V | 5V | 5V | 5V | 5V | 5V | 5V